# Altium schematic sheet Sheet1_Palm.SchDoc
size A3; SheetNumber: 1; SheetTotal: 2
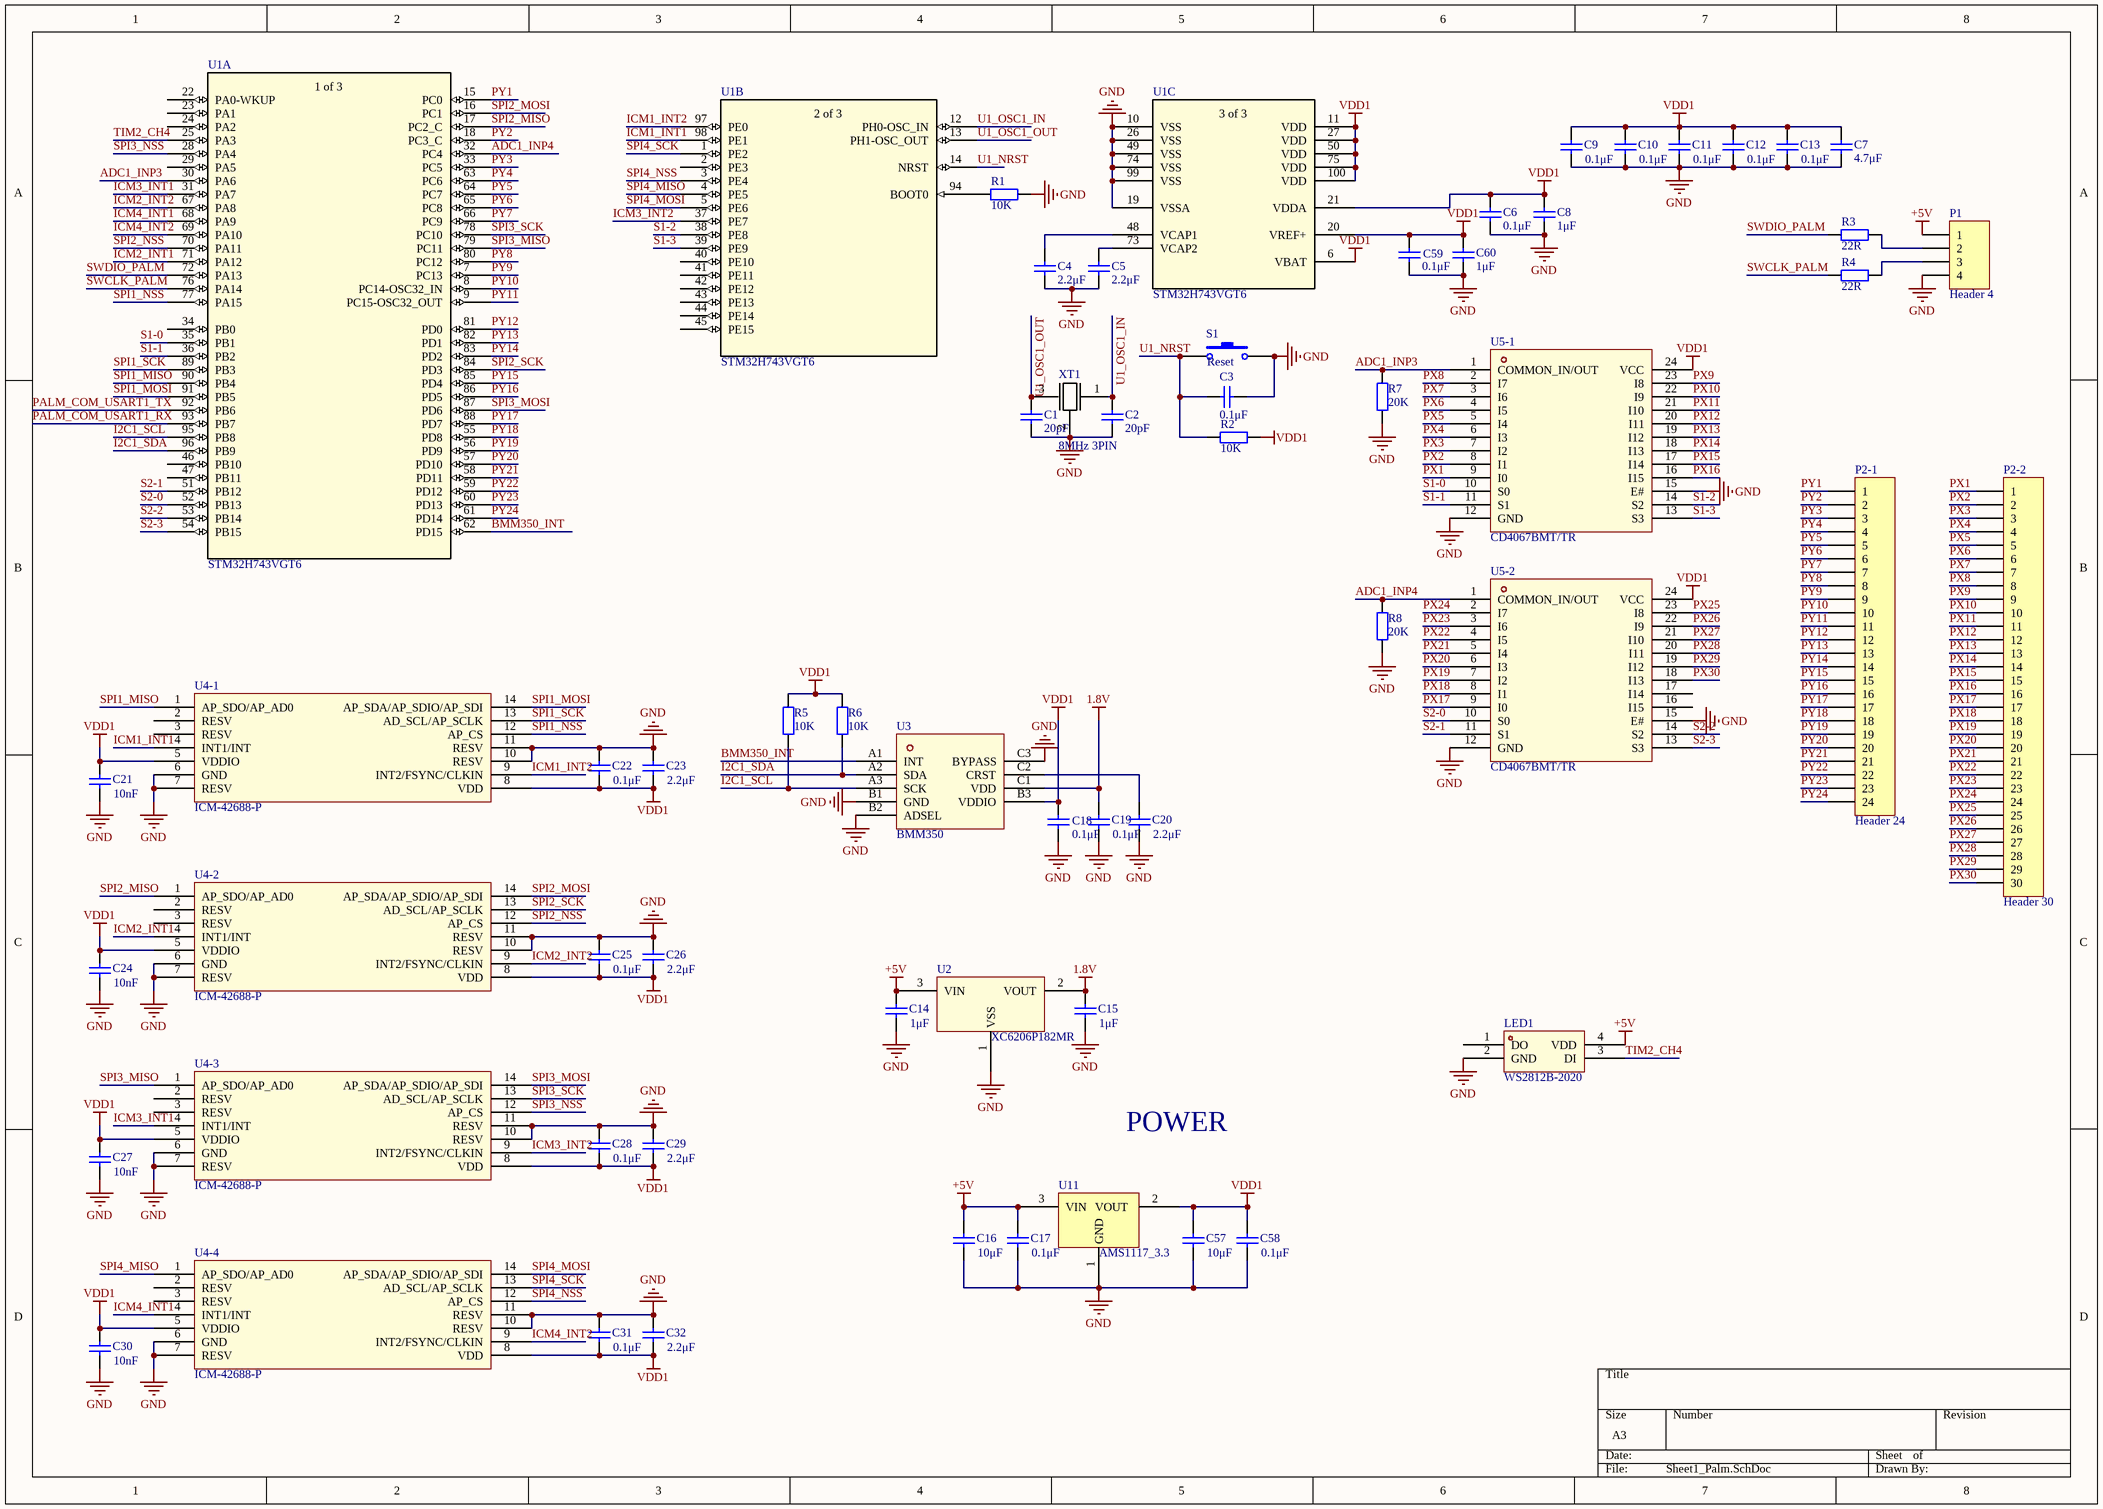
[diagram p0: Sheet1_Palm.SchDoc]

## Parts
C1  20pF  [C0402]
C2  20pF  [C0402]
C3  0.1μF  [C0402]
C4  2.2μF  [C0402]
C5  2.2μF  [C0402]
C6  0.1μF  [C0402]
C7  4.7μF  [C0402]
C8  1μF  [C0402]
C9  0.1μF  [C0402]
C10  0.1μF  [C0402]
C11  0.1μF  [C0402]
C12  0.1μF  [C0402]
C13  0.1μF  [C0402]
C14  1μF  [C0402]
C15  1μF  [C0402]
C16  10μF  [C0402]
C17  0.1μF  [C0402]
C18  0.1μF  [C0402]
C19  0.1μF  [C0402]
C20  2.2μF  [C0402]
C21  10nF  [C0402]
C22  0.1μF  [C0402]
C23  2.2μF  [C0402]
C24  10nF  [C0402]
C25  0.1μF  [C0402]
C26  2.2μF  [C0402]
C27  10nF  [C0402]
C28  0.1μF  [C0402]
C29  2.2μF  [C0402]
C30  10nF  [C0402]
C31  0.1μF  [C0402]
C32  2.2μF  [C0402]
C57  10μF  [C0402]
C58  0.1μF  [C0402]
C59  0.1μF  [C0402]
C60  1μF  [C0402]
LED1  WS2812B-2020  [LED-SMD_4P-L2.0-W2.0-TL_WS2812B-2020]
P1  Header 4  [CONN-SMD_XDWF-0910-04P]
P2-1  Header 24  [FPC-SMD_F0502-B-24-10G-R]
P2-2  Header 30  [FPC-SMD_30P-P0.50_HCTL_HC-FPC-05-10-30RLTAG]
R1  10K  [R0402]
R2  10K  [R0402]
R3  22R  [R0402]
R4  22R  [R0402]
R5  10K  [R0402]
R6  10K  [R0402]
R7  20K  [R0402]
R8  20K  [R0402]
S1  Reset  [SW-SMD_L3.9-W3.0-P4.45]
U1  STM32H743VGT6  [LQFP100-14x14mm]  (parts A,B,C of 3)
U2  XC6206P182MR  [SOT-23-3_L3.0-W1.7-P0.95-LS2.9-BR]
U3  BMM350  [WLCSP-9_L1.3-W1.3-R3-C3-P0.40-TL]
U4-1  ICM-42688-P  [LGA-14_L3.0-W2.5-P0.50-TL]
U4-2  ICM-42688-P  [LGA-14_L3.0-W2.5-P0.50-TL]
U4-3  ICM-42688-P  [LGA-14_L3.0-W2.5-P0.50-TL]
U4-4  ICM-42688-P  [LGA-14_L3.0-W2.5-P0.50-TL]
U5-1  CD4067BMT/TR  [TSSOP-24_L7.8-W4.4-P0.65-LS6.4-BL_1]
U5-2  CD4067BMT/TR  [TSSOP-24_L7.8-W4.4-P0.65-LS6.4-BL_1]
U11  AMS1117_3.3  [AMS1117-3.3]
XT1  8MHz 3PIN  [8MHz 0.07% OSC-SMD_3P-L3.2-W1.3-P1.20-L]

## Nets
1.8V: C15.2 C19.2 U2.2(VOUT) U3.C1(VDD)
+5V: C14.2 C16.2 C17.2 LED1.4(VDD) P1.1 U2.3(VIN) U11.3(VIN)
GND: C1.1 C2.1 C3.2 C4.1 C5.1 C6.2 C7.2 C8.2 C9.1 C10.1 C11.1 C12.1 C13.1 C14.1 C15.1 C16.1 C17.1 C18.1 C19.1 C20.1 C21.1 C22.2 C23.2 C24.1 C25.2 C26.2 C27.1 C28.2 C29.2 C30.1 C31.2 C32.2 C57.1 C58.1 C59.2 C60.2 LED1.2(GND) P1.4 R1.1 R7.1 R8.1 S1.2 U1.10(VSS) U1.19(VSSA) U1.26(VSS) U1.49(VSS) U1.74(VSS) U1.99(VSS) U2.1(VSS) U3.B1(GND) U3.B2(ADSEL) U3.C3(BYPASS) U4-1.6(GND) U4-1.7(RESV) U4-1.10(RESV) U4-1.11(RESV) U4-2.6(GND) U4-2.7(RESV) U4-2.10(RESV) U4-2.11(RESV) U4-3.6(GND) U4-3.7(RESV) U4-3.10(RESV) U4-3.11(RESV) U4-4.6(GND) U4-4.7(RESV) U4-4.10(RESV) U4-4.11(RESV) U5-1.12(GND) U5-1.15(E#) U5-2.12(GND) U5-2.15(E#) U11.1(GND) XT1.2(GND)
VDD1: C6.1 C7.1 C8.1 C9.2 C10.2 C11.2 C12.2 C13.2 C18.2 C21.2 C22.1 C23.1 C24.2 C25.1 C26.1 C27.2 C28.1 C29.1 C30.2 C31.1 C32.1 C57.2 C58.2 C59.1 C60.1 R2.2 R5.1 R6.1 U1.6(VBAT) U1.11(VDD) U1.20(VREF+) U1.21(VDDA) U1.27(VDD) U1.50(VDD) U1.75(VDD) U1.100(VDD) U3.B3(VDDIO) U4-1.5(VDDIO) U4-1.8(VDD) U4-2.5(VDDIO) U4-2.8(VDD) U4-3.5(VDDIO) U4-3.8(VDD) U4-4.5(VDDIO) U4-4.8(VDD) U5-1.24(VCC) U5-2.24(VCC) U11.2(VOUT)
ADC1_INP3: R7.2 U1.30(PA6) U5-1.1(COMMON_IN/OUT)
ADC1_INP4: R8.2 U1.32(PC4) U5-2.1(COMMON_IN/OUT)
BMM350_INT: U1.62(PD15) U3.A1(INT)
I2C1_SCL: R5.2 U1.95(PB8) U3.A3(SCK)
I2C1_SDA: R6.2 U1.96(PB9) U3.A2(SDA)
ICM1_INT1: U1.98(PE1) U4-1.4(INT1/INT)
ICM1_INT2: U1.97(PE0) U4-1.9(INT2/FSYNC/CLKIN)
ICM2_INT1: U1.71(PA12) U4-2.4(INT1/INT)
ICM2_INT2: U1.67(PA8) U4-2.9(INT2/FSYNC/CLKIN)
ICM3_INT1: U1.31(PA7) U4-3.4(INT1/INT)
ICM3_INT2: U1.37(PE7) U4-3.9(INT2/FSYNC/CLKIN)
ICM4_INT1: U1.68(PA9) U4-4.4(INT1/INT)
ICM4_INT2: U1.69(PA10) U4-4.9(INT2/FSYNC/CLKIN)
PALM_COM_USART1_RX: U1.93(PB7)
PALM_COM_USART1_TX: U1.92(PB6)
PX1: P2-2.1 U5-1.9(I0)
PX2: P2-2.2 U5-1.8(I1)
PX3: P2-2.3 U5-1.7(I2)
PX4: P2-2.4 U5-1.6(I3)
PX5: P2-2.5 U5-1.5(I4)
PX6: P2-2.6 U5-1.4(I5)
PX7: P2-2.7 U5-1.3(I6)
PX8: P2-2.8 U5-1.2(I7)
PX9: P2-2.9 U5-1.23(I8)
PX10: P2-2.10 U5-1.22(I9)
PX11: P2-2.11 U5-1.21(I10)
PX12: P2-2.12 U5-1.20(I11)
PX13: P2-2.13 U5-1.19(I12)
PX14: P2-2.14 U5-1.18(I13)
PX15: P2-2.15 U5-1.17(I14)
PX16: P2-2.16 U5-1.16(I15)
PX17: P2-2.17 U5-2.9(I0)
PX18: P2-2.18 U5-2.8(I1)
PX19: P2-2.19 U5-2.7(I2)
PX20: P2-2.20 U5-2.6(I3)
PX21: P2-2.21 U5-2.5(I4)
PX22: P2-2.22 U5-2.4(I5)
PX23: P2-2.23 U5-2.3(I6)
PX24: P2-2.24 U5-2.2(I7)
PX25: P2-2.25 U5-2.23(I8)
PX26: P2-2.26 U5-2.22(I9)
PX27: P2-2.27 U5-2.21(I10)
PX28: P2-2.28 U5-2.20(I11)
PX29: P2-2.29 U5-2.19(I12)
PX30: P2-2.30 U5-2.18(I13)
PY1: P2-1.1 U1.15(PC0)
PY2: P2-1.2 U1.18(PC3_C)
PY3: P2-1.3 U1.33(PC5)
PY4: P2-1.4 U1.63(PC6)
PY5: P2-1.5 U1.64(PC7)
PY6: P2-1.6 U1.65(PC8)
PY7: P2-1.7 U1.66(PC9)
PY8: P2-1.8 U1.80(PC12)
PY9: P2-1.9 U1.7(PC13)
PY10: P2-1.10 U1.8(PC14-OSC32_IN)
PY11: P2-1.11 U1.9(PC15-OSC32_OUT)
PY12: P2-1.12 U1.81(PD0)
PY13: P2-1.13 U1.82(PD1)
PY14: P2-1.14 U1.83(PD2)
PY15: P2-1.15 U1.85(PD4)
PY16: P2-1.16 U1.86(PD5)
PY17: P2-1.17 U1.88(PD7)
PY18: P2-1.18 U1.55(PD8)
PY19: P2-1.19 U1.56(PD9)
PY20: P2-1.20 U1.57(PD10)
PY21: P2-1.21 U1.58(PD11)
PY22: P2-1.22 U1.59(PD12)
PY23: P2-1.23 U1.60(PD13)
PY24: P2-1.24 U1.61(PD14)
S1-0: U1.35(PB1) U5-1.10(S0)
S1-1: U1.36(PB2) U5-1.11(S1)
S1-2: U1.38(PE8) U5-1.14(S2)
S1-3: U1.39(PE9) U5-1.13(S3)
S2-0: U1.52(PB13) U5-2.10(S0)
S2-1: U1.51(PB12) U5-2.11(S1)
S2-2: U1.53(PB14) U5-2.14(S2)
S2-3: U1.54(PB15) U5-2.13(S3)
SPI1_MISO: U1.90(PB4) U4-1.1(AP_SDO/AP_AD0)
SPI1_MOSI: U1.91(PB5) U4-1.14(AP_SDA/AP_SDIO/AP_SDI)
SPI1_NSS: U1.77(PA15) U4-1.12(AP_CS)
SPI1_SCK: U1.89(PB3) U4-1.13(AD_SCL/AP_SCLK)
SPI2_MISO: U1.17(PC2_C) U4-2.1(AP_SDO/AP_AD0)
SPI2_MOSI: U1.16(PC1) U4-2.14(AP_SDA/AP_SDIO/AP_SDI)
SPI2_NSS: U1.70(PA11) U4-2.12(AP_CS)
SPI2_SCK: U1.84(PD3) U4-2.13(AD_SCL/AP_SCLK)
SPI3_MISO: U1.79(PC11) U4-3.1(AP_SDO/AP_AD0)
SPI3_MOSI: U1.87(PD6) U4-3.14(AP_SDA/AP_SDIO/AP_SDI)
SPI3_NSS: U1.28(PA4) U4-3.12(AP_CS)
SPI3_SCK: U1.78(PC10) U4-3.13(AD_SCL/AP_SCLK)
SPI4_MISO: U1.4(PE5) U4-4.1(AP_SDO/AP_AD0)
SPI4_MOSI: U1.5(PE6) U4-4.14(AP_SDA/AP_SDIO/AP_SDI)
SPI4_NSS: U1.3(PE4) U4-4.12(AP_CS)
SPI4_SCK: U1.1(PE2) U4-4.13(AD_SCL/AP_SCLK)
SWCLK_PALM: R4.1 U1.76(PA14)
SWDIO_PALM: R3.1 U1.72(PA13)
TIM2_CH4: LED1.3(DI) U1.25(PA3)
U1_NRST: C3.1 R2.1 S1.1 U1.14(NRST)
U1_OSC1_IN: C2.2 U1.12(PH0-OSC_IN) XT1.1(OUTPUT)
U1_OSC1_OUT: C1.2 U1.13(PH1-OSC_OUT) XT1.3(INPUT)
NetC4_2: C4.2 U1.48(VCAP1)
NetC5_2: C5.2 U1.73(VCAP2)
NetC20_2: C20.2 U3.C2(CRST)
NetP1_2: P1.2 R3.2
NetP1_3: P1.3 R4.2
NetR1_2: R1.2 U1.94(BOOT0)

Not connected (* = marked no-connect by the designer): LED1 1(DO); U1 2(PE3) 22(PA0-WKUP) 23(PA1) 24(PA2) 29(PA5) 34(PB0) 40(PE10) 41(PE11) 42(PE12) 43(PE13) 44(PE14) 45(PE15) 46(PB10) 47(PB11); U4-1 2(RESV) 3(RESV); U4-2 2(RESV) 3(RESV); U4-3 2(RESV) 3(RESV); U4-4 2(RESV) 3(RESV); U5-2 16(I15) 17(I14)

## Notes on the sheet
- POWER
- (in symbol STM32H743VGT6, part A) 1 of 3
- (in symbol STM32H743VGT6, part B) 2 of 3
- (in symbol STM32H743VGT6, part C) 3 of 3

## Library data of the parts
C1-C32 C57-C60 = Cap Semi: Capacitor (Semiconductor SIM Model); Published: 8-Jun-2000; LatestRevisionDate: 29-May-2009; LatestRevisionNote: IPC-7351 Footprint Added.; PackageReference: C1206; Publisher: Altium Limited; PackageDescription: Chip Capacitor
P1 = Header 4: XDWF-0910-04P; LatestRevisionDate: 17-Jul-2002; LatestRevisionNote: Re-released for DXP Platform.; Publisher: Altium Limited
P2-1 = Header 24: Header, 24-Pin; LatestRevisionDate: 17-Jul-2002; LatestRevisionNote: Re-released for DXP Platform.; Publisher: Altium Limited
P2-2 = Header 30: Header, 30-Pin; LatestRevisionDate: 17-Jul-2002; LatestRevisionNote: Re-released for DXP Platform.; Publisher: Altium Limited
R1-R8 = Res2: Resistor; Published: 8-Jun-2000; LatestRevisionDate: 17-Jul-2002; LatestRevisionNote: Re-released for DXP Platform.; PackageReference: AXIAL-0.4; Publisher: Altium Limited; PackageDescription: Axial Device, Thru-Hole; 2 Leads; 0.4 in Pin Spacing
S1 = SW-PB: TS-1088R-02026; Published: 24-Mar-1999; LatestRevisionDate: 17-Jul-2002; LatestRevisionNote: Re-released for DXP Platform.; PackageReference: SPST-2; Publisher: Altium Limited; PackageDescription: Switch; 2 Leads
U1 = STM32H743VGT6: No Description Available; Mfr_Name: STMicroelectronics; RefDes: RefDes; Type: Type
U11 = AMS1117_3.3 SOT-89
XT1 = 8MHz 0.07% 3PIN_1: CSTNE8M00GH5C000R0